# EAGLE design Driver4550 (EAGLE 6.2)
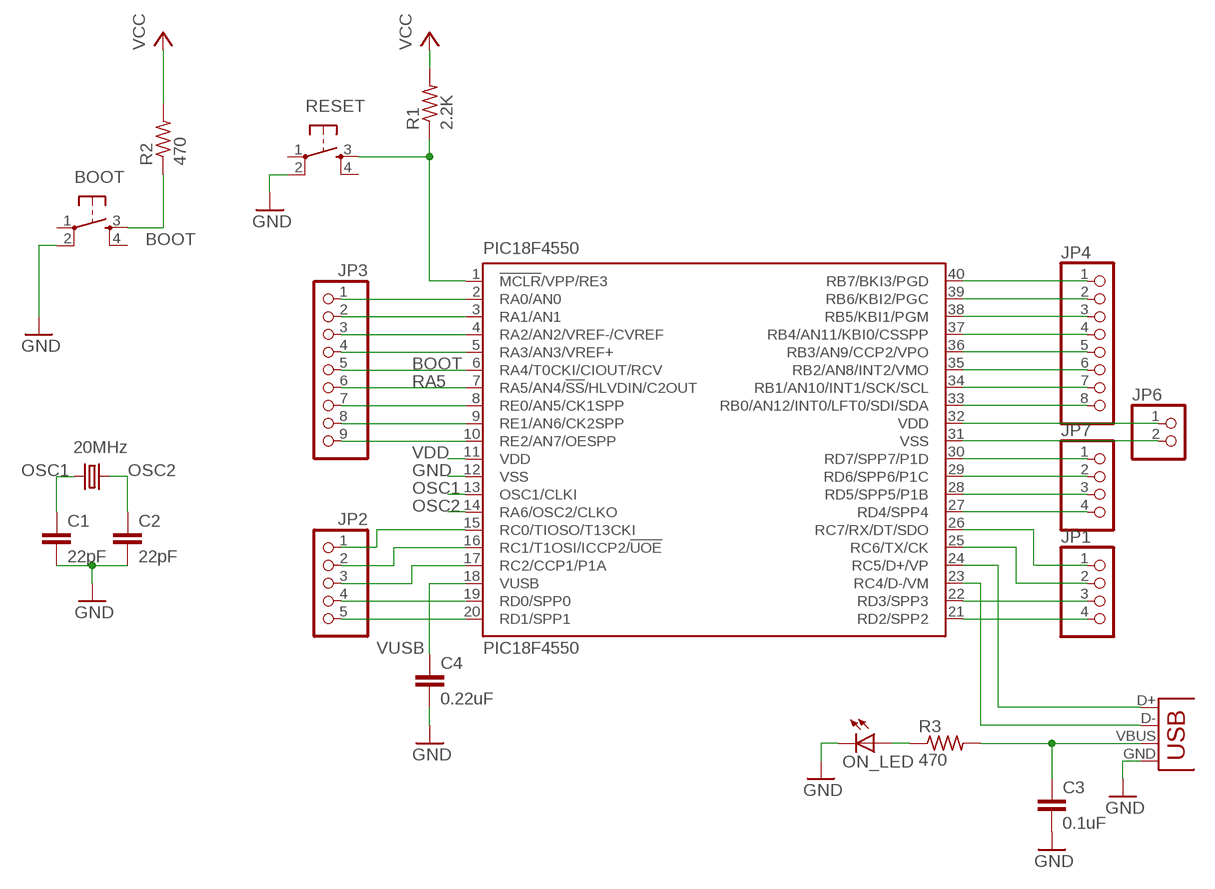
[diagram p0: schematic, sheet 1]

## Parts
BOOT  TAC_SWITCHPTH  [TACTILE-PTH]
C1  22pF  C5/3  [C5B3]
C2  22pF  C5/3  [C5B3]
C3  0.1uF  C2,5-3  [C2.5-3]
C4  0.22uF  C5/3  [C5B3]
CRYSTAL  20MHz  CRYSTALHC49US  [HC49US]
JP1  PINHD-1X4  [1X04]
JP2  PINHD-1X5  [1X05]
JP3  PINHD-1X9  [1X09]
JP4  PINHD-1X8  [1X08]
JP6  PINHD-1X2  [1X02]
JP7  PINHD-1X4  [1X04]
ON_LED  LED3MM  [LED3MM]
PIC18F4550  PIC18F4550  PIC18F4550_40  [DIL40]
R1  2.2K  R-US_0204/7  [0204/7]
R2  470  R-US_0204/7  [0204/7]
R3  470  R-US_0204/7  [0204/7]
RESET  TAC_SWITCHPTH  [TACTILE-PTH]
USB  X1  USBPTH  [USB-B-PTH]

## Nets
B6: JP4.2 PIC18F4550.39(RB6/KBI2/PGC)
B7: JP4.1 PIC18F4550.40(RB7/BKI3/PGD)
BOOT: BOOT.3 JP3.5 PIC18F4550.6(RA4/T0CKI/CIOUT/RCV) R2.1
D0: JP2.4 PIC18F4550.19(RD0/SPP0)
D1: JP2.5 PIC18F4550.20(RD1/SPP1)
D2: JP1.4 PIC18F4550.21(RD2/SPP2)
D4: JP7.4 PIC18F4550.27(RD4/SPP4)
D5: JP7.3 PIC18F4550.28(RD5/SPP5/P1B)
D6: JP7.2 PIC18F4550.29(RD6/SPP6/P1C)
D7: JP7.1 PIC18F4550.30(RD7/SPP7/P1D)
D+: PIC18F4550.24(RC5/D+/VP) USB.D+
D-: PIC18F4550.23(RC4/D-/VM) USB.D-
GND: BOOT.2 C1.2 C2.2 C3.2 C4.2 JP6.2 ON_LED.K(C) PIC18F4550.12(VSS) PIC18F4550.31(VSS) RESET.2 USB.GND
N$1: JP1.3 PIC18F4550.22(RD3/SPP3)
N$4: JP2.1 PIC18F4550.15(RC0/TIOSO/T13CKI)
N$5: JP1.2 PIC18F4550.25(RC6/TX/CK)
N$6: JP1.1 PIC18F4550.26(RC7/RX/DT/SDO)
N$7: PIC18F4550.1(!MCLR!/VPP/RE3) R1.1 RESET.3
N$11: JP2.2 PIC18F4550.16(RC1/T1OSI/ICCP2/!UOE)
N$12: ON_LED.A R3.1
N$13: JP4.8 PIC18F4550.33(RB0/AN12/INT0/LFT0/SDI/SDA)
N$14: JP4.7 PIC18F4550.34(RB1/AN10/INT1/SCK/SCL)
N$15: JP4.6 PIC18F4550.35(RB2/AN8/INT2/VMO)
N$16: JP4.5 PIC18F4550.36(RB3/AN9/CCP2/VPO)
N$17: JP4.4 PIC18F4550.37(RB4/AN11/KBI0/CSSPP)
N$18: JP4.3 PIC18F4550.38(RB5/KBI1/PGM)
N$19: JP2.3 PIC18F4550.17(RC2/CCP1/P1A)
N$22: JP3.1 PIC18F4550.2(RA0/AN0)
N$23: JP3.2 PIC18F4550.3(RA1/AN1)
N$24: JP3.3 PIC18F4550.4(RA2/AN2/VREF-/CVREF)
N$25: JP3.4 PIC18F4550.5(RA3/AN3/VREF+)
N$28: JP3.7 PIC18F4550.8(RE0/AN5/CK1SPP)
N$29: JP3.8 PIC18F4550.9(RE1/AN6/CK2SPP)
N$30: JP3.9 PIC18F4550.10(RE2/AN7/OESPP)
OSC1: C1.1 CRYSTAL.2 PIC18F4550.13(OSC1/CLKI)
OSC2: C2.1 CRYSTAL.1 PIC18F4550.14(RA6/OSC2/CLKO)
RA5: JP3.6 PIC18F4550.7(RA5/AN4/!SS!/HLVDIN/C2OUT)
VDD: C3.1 JP6.1 PIC18F4550.11(VDD) PIC18F4550.32(VDD) R1.2 R2.2 R3.2 USB.VBUS ; supply symbol labelled VCC
VUSB: C4.1 PIC18F4550.18(VUSB)
Unconnected: BOOT.1 BOOT.4 RESET.1 RESET.4

## Library data of the parts
BOOT RESET = SparkFun:TAC_SWITCH: Momentary Switch Button commonly used for reset or general input. Spark Fun Electronics SKU : COM-00097
C1-C4 = capacitor-wima:C: CAPACITOR naming: grid - package width
CRYSTAL = SparkFun:CRYSTAL: Crystals Various standard crystals. Proven footprints. Spark Fun Electronics SKU : COM-00534
JP1 JP7 = pinhead:PINHD-1X4: PIN HEADER
JP2 = pinhead:PINHD-1X5: PIN HEADER
JP3 = pinhead:PINHD-1X9: PIN HEADER
JP4 = pinhead:PINHD-1X8: PIN HEADER
JP6 = pinhead:PINHD-1X2: PIN HEADER
ON_LED = adafruit:LED: LED OSRAM: - CHIPLED LG R971, LG N971, LY N971, LG Q971, LY Q971, LO R971, LY R971 LH N974, LH R974 LS Q976, LO Q976, LY Q976 LO Q996 - Hyper CHIPLED LW Q18S LB Q993, LB Q99A, LB R99A - SideLED LS A670, LO A670, LY A670, LG A670, LP A670 LB A673, LV A673, LT A673, LW A673 LH A674 LY A675 LS A676, LA A676, LO A676, LY A676, LW A676 LS A679, LY A679, LG A679 - Hyper Micro SIDELED® LS Y876, LA Y876, LO Y876, LY Y876 LT Y87S - SmartLED LW L88C, LW L88S LB L89C, LB L89S, LG L890 LS L89K, LO L89K, LY L89K LS L896, LA L896, LO L896, LY L896 - TOPLED LS T670, LO T670, LY T670, LG T670, LP T670 LSG T670, LSP T670, LSY T670, LOP T670, LYG T670 LG T671, LOG T671, LSG T671 LB T673, LV T673, LT T673, LW T673 LH T674 LS T676, LA T676, LO T676, LY T676, LB T676, LH T676, LSB T676, LW T676 LB T67C, LV T67C, LT T67C, LS T67K, LO T67K, LY T67K, LW E67C LS E67B, LA E67B, LO E67B, LY E67B, LB E67C, LV E67C, LT E67C LW T67C LS T679, LY T679, LG T679 LS T770, LO T770, LY T770, LG T770, LP T770 LB T773, LV T773, LT T773, LW T773 LH T774 LS E675, LA E675, LY E675, LS T675 LS T776, LA T776, LO T776, LY T776, LB T776 LHGB T686 LT T68C, LB T68C - Hyper Mini TOPLED® LB M676 - Mini TOPLED Santana® LG M470 LS M47K, LO M47K, LY M47K Source: http://www.osram.convergy.de/
PIC18F4550 = microchip:PIC18F4*_40: USB Microcontrollers with nanoWatt Technology High-Performance, Enhanced Flash, 28/40/44-Pin, Source: http://ww1.microchip.com/downloads/en/devicedoc/39632c.pdf; MF: MICROCHIP; MPN: PIC18F4550-I/P; OC_FARNELL: 9321357; OC_NEWARK: 74K8623
R1-R3 = resistor:R-US_: RESISTOR, American symbol
USB = SparkFun:USB: USB Connectors USB-B-PTH is fully proven SKU : PRT-00139 USB-miniB is fully proven SKU : PRT-00587 USB-A-PCB is untested. USB-A-H is throughly reviewed, but untested. Spark Fun Electronics SKU : PRT-00437 USB-B-SMT is throughly reviewed, but untested. Needs silkscreen touching up. USB-A-S has not been used/tested USB-MB-H has not been used/tested

## Board
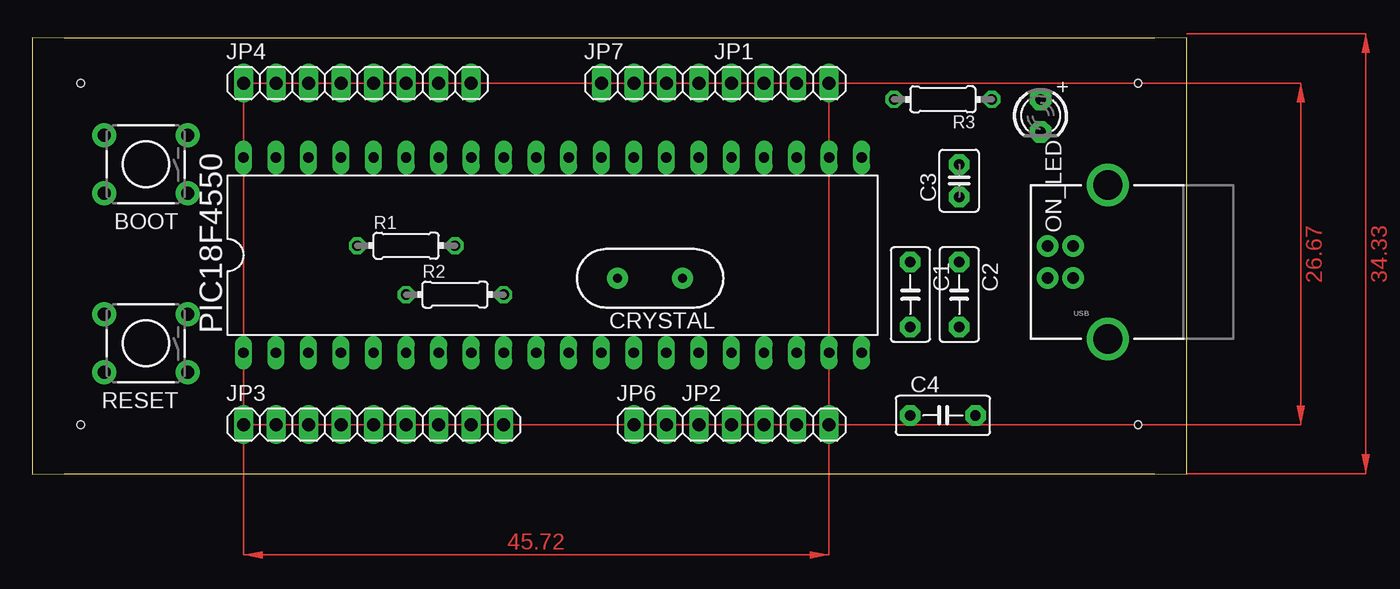
[diagram p1: board, top side]
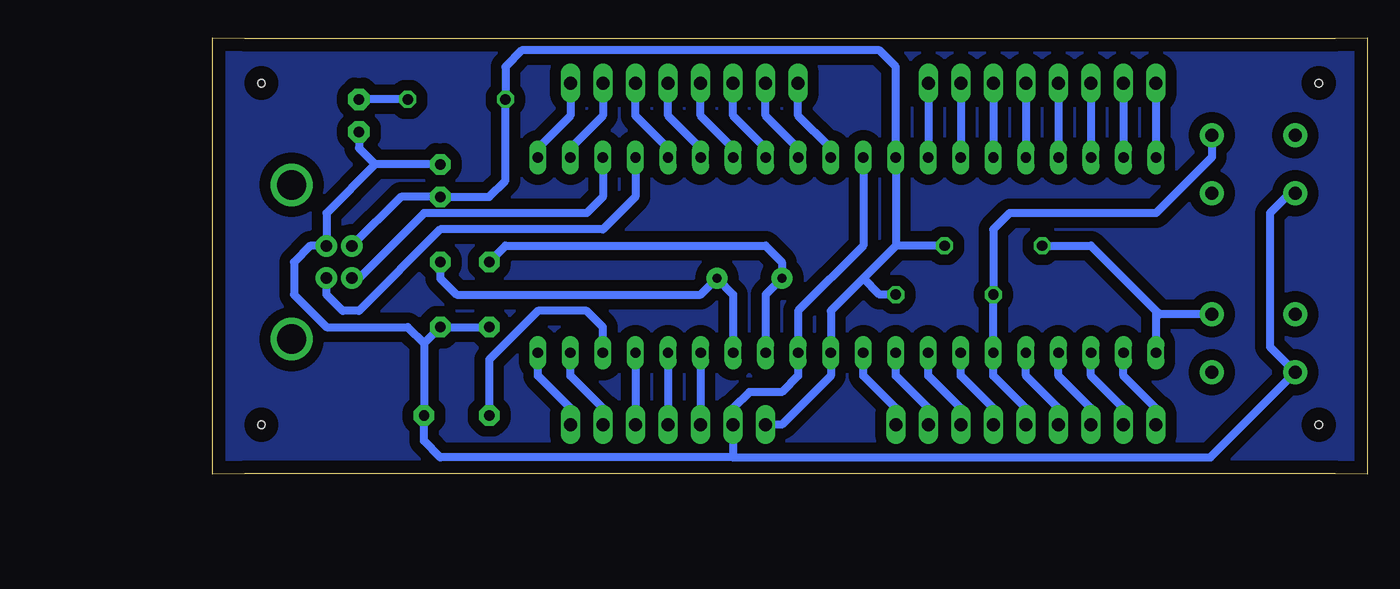
[diagram p2: board, bottom side, seen from below]

Size 90.15 x 34.04 mm. Coordinates in mm from the lower left corner, seen from the top.
Outline: 0,0 2.5,0.04 87.65,0.04 90.15,0 90.15,34.04 87.65,34 2.5,34 0,34.04 0,0
Copper layers (1*16): Top 0.035mm / dielectric 1.5mm / Bottom 0.035mm
Design rules "default": minimum track width 10mil, minimum drill 24mil, track to track 8mil, track to pad 8mil, pad to pad 8mil, via to via 8mil, smd to smd 8mil, copper to edge 40mil, drill to drill 8mil, minimum pad ring 10mil, minimum via ring 8mil, stop-mask expansion 4mil, vias tented up to drill 0mil, thermal gap 10mil
Holes 0.6 mm at 3.81,3.85 3.81,30.52 86.36,30.52 86.36,3.85

### Footprints (pad centres in the part's own frame; a part is rotated, then mirrored left to right if it is on the bottom)
TACTILE-PTH = drill 1.016 pad 1.88: 1 -3.251,2.261; 2 3.251,2.261; 3 -3.251,-2.261; 4 3.251,-2.261
C5B3 = drill 0.813 pad 1.6 octagon: 1 -2.54,0; 2 2.54,0
C2.5-3 = drill 0.813 pad 1.6 octagon: 1 -1.27,0; 2 1.27,0
HC49US = drill 0.7 pad 1.651: 1 -2.54,0; 2 2.54,0
1X04 = drill 1.016 long: 1 -3.81,0; 2 -1.27,0; 3 1.27,0; 4 3.81,0
1X05 = drill 1.016 long: 1 -5.08,0; 2 -2.54,0; 3 0,0; 4 2.54,0; 5 5.08,0
1X09 = drill 1.016 long: 1 -10.16,0; 2 -7.62,0; 3 -5.08,0; 4 -2.54,0; 5 0,0; 6 2.54,0; 7 5.08,0; 8 7.62,0; 9 10.16,0
1X08 = drill 1.016 long: 1 -8.89,0; 2 -6.35,0; 3 -3.81,0; 4 -1.27,0; 5 1.27,0; 6 3.81,0; 7 6.35,0; 8 8.89,0
1X02 = drill 1.016 long: 1 -1.27,0; 2 1.27,0
LED3MM = drill 0.813 pad 1.676 octagon: A -1.27,0; K 1.27,0
DIL40 = drill 0.813 long: 1 -24.13,-7.62; 2 -21.59,-7.62; 3 -19.05,-7.62; 4 -16.51,-7.62; 5 -13.97,-7.62; 6 -11.43,-7.62; 7 -8.89,-7.62; 8 -6.35,-7.62; 9 -3.81,-7.62; 10 -1.27,-7.62; 11 1.27,-7.62; 12 3.81,-7.62; 13 6.35,-7.62; 14 8.89,-7.62; 15 11.43,-7.62; 16 13.97,-7.62; 17 16.51,-7.62; 18 19.05,-7.62; 19 21.59,-7.62; 20 24.13,-7.62; 21 24.13,7.62; 22 21.59,7.62; 23 19.05,7.62; 24 16.51,7.62; 25 13.97,7.62; 26 11.43,7.62; 27 8.89,7.62; 28 6.35,7.62; 29 3.81,7.62; 30 1.27,7.62; 31 -1.27,7.62; 32 -3.81,7.62; 33 -6.35,7.62; 34 -8.89,7.62; 35 -11.43,7.62; 36 -13.97,7.62; 37 -16.51,7.62; 38 -19.05,7.62; 39 -21.59,7.62; 40 -24.13,7.62
0204/7 = drill 0.813 octagon: 1 -3.81,0; 2 3.81,0
USB-B-PTH = drill 0.914 pad 1.676: D+ 0,1.25; D- 1.981,1.25; GND 0,-1.25; VBUS 1.981,-1.25 | drill 2.286: S1 -2.718,-6.02; S2 -2.718,6.02

### Placement (x,y rotation side)
BOOT  8.89,24.17 180 top
C1  68.58,14.01 270 top
C2  72.39,14.01 270 top
C3  72.39,22.9 90 top
C4  71.12,4.58 0 top
CRYSTAL  48.26,15.28 180 top
JP1  58.42,30.52 0 top
JP2  57.15,3.85 0 top
JP3  26.67,3.85 0 top
JP4  25.4,30.52 0 top
JP6  48.26,3.85 0 top
JP7  48.26,30.52 0 top
ON_LED  78.74,27.98 270 top
PIC18F4550  40.64,17.09 0 top
R1  29.21,17.82 0 top
R2  33.02,14.01 0 top
R3  71.12,29.25 180 top
RESET  8.89,10.2 180 top
USB  81.28,16.55 180 top

### Tracks (layer width: path | path; a pad name or v marks a point on that pad's centre or on a via)
B6
  Bottom 0.61: JP4.2 PIC18F4550.39
B7
  Bottom 0.61: JP4.1 PIC18F4550.40
BOOT
  Bottom 0.61: JP3.5 26.67,5.12 29.21,7.66 PIC18F4550.6 R2.1 29.21,19.09 27.94,20.36 16.51,20.36 12.14,24.73 BOOT.3
D0
  Bottom 0.61: JP2.4 59.69,5.12 62.23,7.66 PIC18F4550.19
D1
  Bottom 0.61: JP2.5 62.23,5.12 64.77,7.66 PIC18F4550.20
D2
  Bottom 0.61: JP1.4 62.23,27.98 64.77,25.44 PIC18F4550.21
D4
  Bottom 0.61: PIC18F4550.27 49.53,25.44 52.07,27.98 JP7.4
D5
  Bottom 0.61: PIC18F4550.28 46.99,25.44 49.53,27.98 JP7.3
D6
  Bottom 0.61: PIC18F4550.29 44.45,25.44 46.99,27.98 JP7.2
D7
  Bottom 0.61: PIC18F4550.30 41.91,25.44 44.45,27.98 JP7.1
D+
  Bottom 0.61: PIC18F4550.24 57.15,21.63 59.69,19.09 72.39,19.09 78.74,12.74 80.01,12.74 81.28,14.01 USB.D+
D-
  Bottom 0.61: PIC18F4550.23 59.69,21.63 60.96,20.36 73.66,20.36 78.74,15.28 79.28,15.28 USB.D-
GND
  Bottom 0.61: C1.2 C2.2 73.66,10.2 | PIC18F4550.31 39.37,17.82 44.45,12.74 PIC18F4550.12 44.45,7.66 45.72,6.39 48.26,6.39 49.53,5.12 JP6.2 49.53,1.31 | C3.2 77.47,24.17 | 77.47,24.17 81.28,20.36 USB.GND 82.57,17.8 83.82,16.55 83.82,14.01 81.28,11.47 74.93,11.47 73.66,10.2 | 73.66,10.2 C4.2 73.66,2.58 72.39,1.31 49.53,1.31 | RESET.2 5.36,7.94 | 49.53,1.31 12.27,1.31 RESET.2 | ON_LED.K 78.74,25.44 77.47,24.17 | RESET.2 7.62,9.92 7.62,20.36 6.07,21.91 BOOT.2
N$1
  Bottom 0.61: JP1.3 59.69,27.98 62.23,25.44 PIC18F4550.22
N$3
  pour Bottom (isolate 0.85): 90.17,34.37 90.17,0 86.4,0.04 1.23,0.04 0,0 0,33.1 arc-90 1.23,34.33 86.4,34.33
N$4
  Bottom 0.61: PIC18F4550.15 JP2.1
N$5
  Bottom 0.61: PIC18F4550.25 54.61,25.44 57.15,27.98 JP1.2
N$6
  Bottom 0.61: PIC18F4550.26 52.07,25.44 54.61,27.98 JP1.1
N$7
  Bottom 0.61: 16.51,12.74 PIC18F4550.1 | R1.1 21.59,17.82 16.51,12.74 | RESET.3 16.23,12.46 16.51,12.74
N$11
  Bottom 0.61: PIC18F4550.16 JP2.2
N$12
  Bottom 0.61: R3.1 ON_LED.A
N$13
  Bottom 0.61: JP4.8 PIC18F4550.33
N$14
  Bottom 0.61: JP4.7 PIC18F4550.34
N$15
  Bottom 0.61: JP4.6 PIC18F4550.35
N$16
  Bottom 0.61: JP4.5 PIC18F4550.36
N$17
  Bottom 0.61: JP4.4 PIC18F4550.37
N$18
  Bottom 0.61: JP4.3 PIC18F4550.38
N$19
  Bottom 0.61: PIC18F4550.17 JP2.3
N$22
  Bottom 0.61: JP3.1 16.51,5.12 19.05,7.66 PIC18F4550.2
N$23
  Bottom 0.61: JP3.2 19.05,5.12 21.59,7.66 PIC18F4550.3
N$24
  Bottom 0.61: JP3.3 21.59,5.12 24.13,7.66 PIC18F4550.4
N$25
  Bottom 0.61: JP3.4 24.13,5.12 26.67,7.66 PIC18F4550.5
N$28
  Bottom 0.61: JP3.7 31.75,5.12 34.29,7.66 PIC18F4550.8
N$29
  Bottom 0.61: JP3.8 34.29,5.12 36.83,7.66 PIC18F4550.9
N$30
  Bottom 0.61: JP3.9 36.83,5.12 39.37,7.66 PIC18F4550.10
OSC1
  Bottom 0.61: PIC18F4550.13 46.99,14.01 CRYSTAL.2 45.72,16.55 46.99,17.82 67.31,17.82 C1.1
OSC2
  Bottom 0.61: PIC18F4550.14 49.53,14.01 CRYSTAL.1 52.07,14.01 71.12,14.01 72.39,15.28 C2.1
RA5
  Bottom 0.61: JP3.6 29.21,5.12 31.75,7.66 PIC18F4550.7
VDD
  Bottom 0.61: USB.VBUS 75.47,21.63 C3.1 68.58,21.63 67.31,22.9 R3.2 67.31,31.79 66.04,33.06 38.1,33.06 36.83,31.79 PIC18F4550.32 36.83,17.82 | 36.83,17.82 39.37,15.28 | 39.37,15.28 41.91,12.74 PIC18F4550.11 41.91,7.66 45.72,3.85 JP6.1 | R2.2 38.1,14.01 39.37,15.28 | R1.2 36.83,17.82
VUSB
  Bottom 0.61: C4.1 68.58,8.93 64.77,12.74 60.96,12.74 59.69,11.47 PIC18F4550.18
(copper drawn outside any net)
  shapes: Top area x3

### Text on the board
Labels: BOOT | 180 | B7 | B6 | B5 | B4 | B3 | B2 | B1 | B0 | D7 | D6 | D5 | D4 | C7 | C6 | D3 | D2 | PWR | 0.1 uF | 22 pF | 20 MHZ | 10 K | 10 K | 22 pF | 224 | A0 | A1 | A2 | A3 | A4 | A5 | E0 | E1 | E2 | VCC | C0 | C1 | C2 | D0 | D1 | RESET | GND | Rev.2